# EasyEDA Pro project Relay_5x.epro

# Schematic Relay5x
Create Date: 2024-04-06; Page Name: P1; Project Name: LRIMa Agriculture Lite_2023-04-19_21-05-17; Schematic Name: Relay5x; Update Date: 2024-04-15; Company: EasyEDA.com; Drawn: EasyEDA; Page Size: A3; Part Number: JLCPCB-001; Reviewed: EasyEDA; Version: V0.1
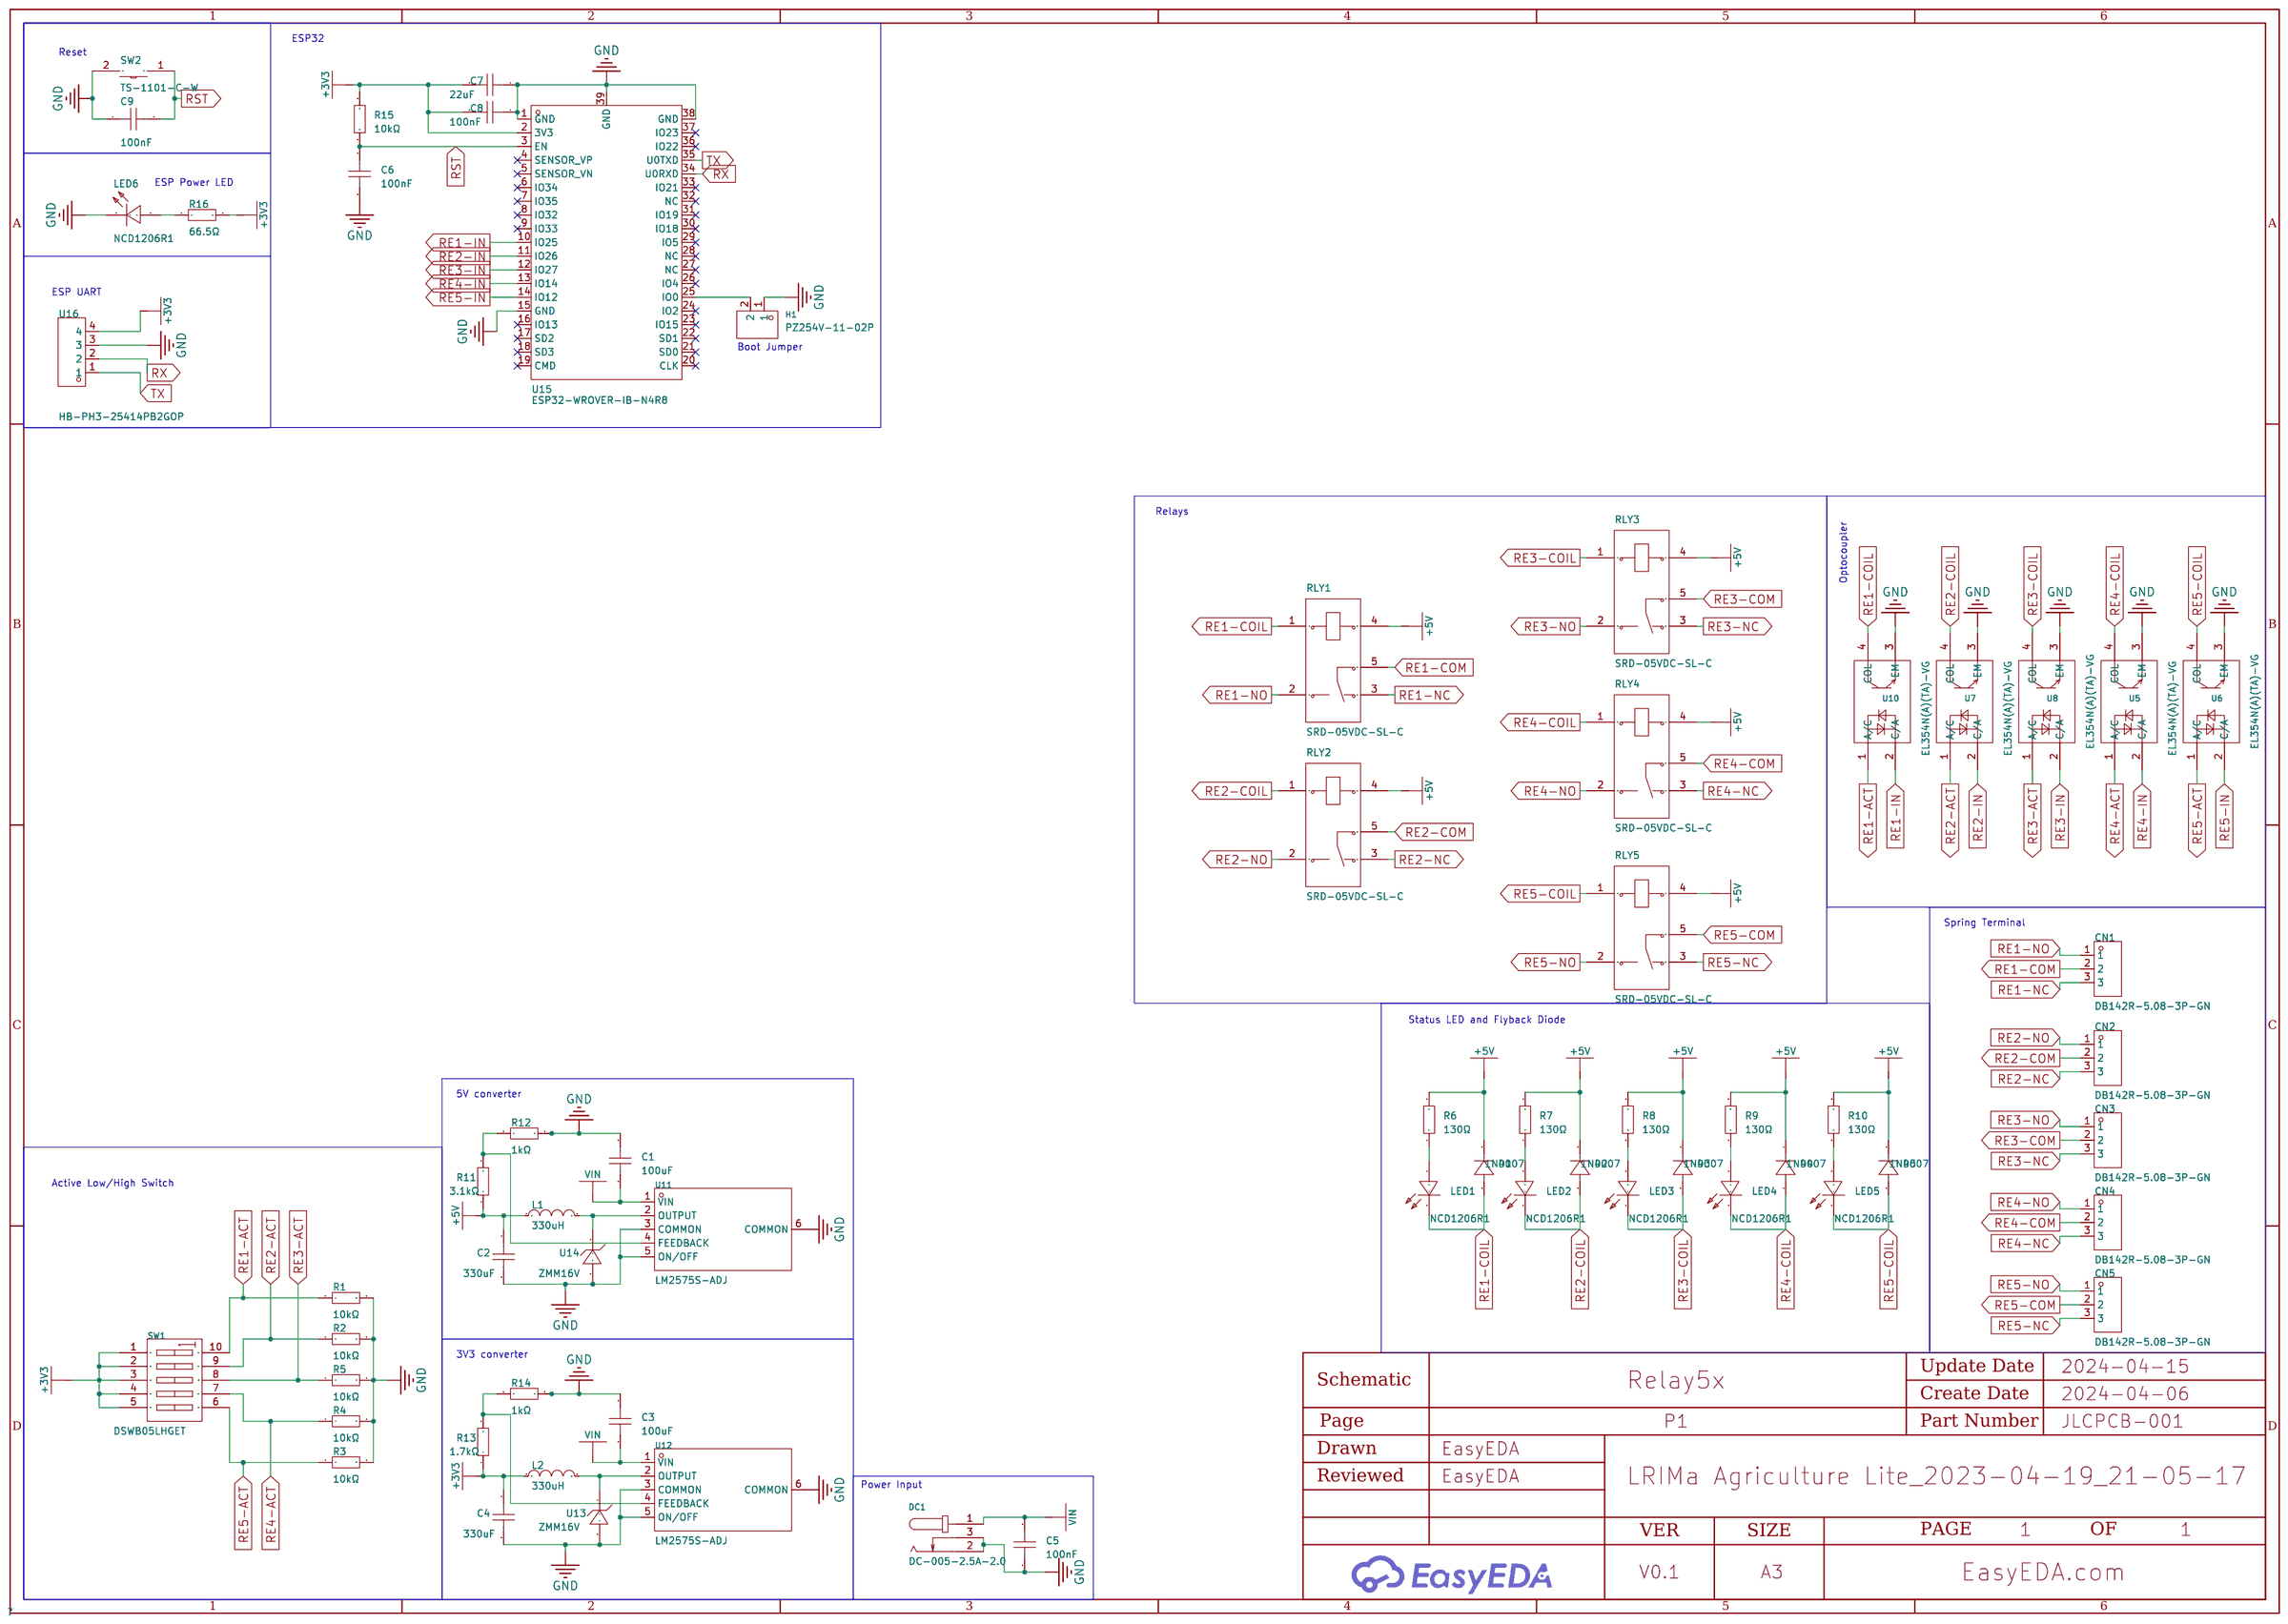
[diagram p0: schematic sheet]

## Parts
C1  100uF  [C1206]
C2  330uF  [C1210]
C3  100uF  [C1206]
C4  330uF  [C1210]
C5  100nF  [C1206]
C6  100nF  [C1206]
C7  22uF  [C1206]
C8  100nF  [C1206]
C9  100nF  [C1206]
CN1  DB142R-5.08-3P-GN  [CONN-TH_3P-P5.08_DIBO_DB142R-5.08-3P]
CN2  DB142R-5.08-3P-GN  [CONN-TH_3P-P5.08_DIBO_DB142R-5.08-3P]
CN3  DB142R-5.08-3P-GN  [CONN-TH_3P-P5.08_DIBO_DB142R-5.08-3P]
CN4  DB142R-5.08-3P-GN  [CONN-TH_3P-P5.08_DIBO_DB142R-5.08-3P]
CN5  DB142R-5.08-3P-GN  [CONN-TH_3P-P5.08_DIBO_DB142R-5.08-3P]
D1  1N4007  [DO-41_BD2.4-L4.7-P8.70-D0.9-RD]
D2  1N4007  [DO-41_BD2.4-L4.7-P8.70-D0.9-RD]
D3  1N4007  [DO-41_BD2.4-L4.7-P8.70-D0.9-RD]
D4  1N4007  [DO-41_BD2.4-L4.7-P8.70-D0.9-RD]
D5  1N4007  [DO-41_BD2.4-L4.7-P8.70-D0.9-RD]
DC1  DC-005-2.5A-2.0  [CONN-TH_DC-005-2.5A-2.0]
H1  PZ254V-11-02P  [HDR-TH_2P-P2.54-V-M]
L1  330uH  [L1210]
L2  330uH  [L1210]
LED1  NCD1206R1  [LED1206-R-RD_RED]
LED2  NCD1206R1  [LED1206-R-RD_RED]
LED3  NCD1206R1  [LED1206-R-RD_RED]
LED4  NCD1206R1  [LED1206-R-RD_RED]
LED5  NCD1206R1  [LED1206-R-RD_RED]
LED6  NCD1206R1  [LED1206-R-RD_RED]
R1  10kΩ  [R1206]
R2  10kΩ  [R1206]
R3  10kΩ  [R1206]
R4  10kΩ  [R1206]
R5  10kΩ  [R1206]
R6  130Ω  [R1206]
R7  130Ω  [R1206]
R8  130Ω  [R1206]
R9  130Ω  [R1206]
R10  130Ω  [R1206]
R11  3.1kΩ  [RES-TH_BD2.3-L3.7-P7.70-D0.9]
R12  1kΩ  [R1206]
R13  1.7kΩ  [RES-TH_BD2.7-L6.2-P10.20-D0.4]
R14  1kΩ  [R1206]
R15  10kΩ  [R1206]
R16  66.5Ω  [R1206]
RLY1  SRD-05VDC-SL-C  [RELAY-TH_SRD-XXVDC-XL-C]
RLY2  SRD-05VDC-SL-C  [RELAY-TH_SRD-XXVDC-XL-C]
RLY3  SRD-05VDC-SL-C  [RELAY-TH_SRD-XXVDC-XL-C]
RLY4  SRD-05VDC-SL-C  [RELAY-TH_SRD-XXVDC-XL-C]
RLY5  SRD-05VDC-SL-C  [RELAY-TH_SRD-XXVDC-XL-C]
SW1  DSWB05LHGET  [SW-TH_DSWB05LHGET]
SW2  TS-1101-C-W  [SW-SMD_L6.0-W3.3-LS8.0]
U5  EL354N(A)(TA)-VG  [OPTO-SMD-4_L4.4-W4.1-P2.54-LS7.0-TL]
U6  EL354N(A)(TA)-VG  [OPTO-SMD-4_L4.4-W4.1-P2.54-LS7.0-TL]
U7  EL354N(A)(TA)-VG  [OPTO-SMD-4_L4.4-W4.1-P2.54-LS7.0-TL]
U8  EL354N(A)(TA)-VG  [OPTO-SMD-4_L4.4-W4.1-P2.54-LS7.0-TL]
U10  EL354N(A)(TA)-VG  [OPTO-SMD-4_L4.4-W4.1-P2.54-LS7.0-TL]
U11  LM2575S-ADJ  [TO-263-5_L10.2-W8.9-P1.70-BR]
U12  LM2575S-ADJ  [TO-263-5_L10.2-W8.9-P1.70-BR]
U13  ZMM16V  [LL-34_L3.5-W1.5-RD]
U14  ZMM16V  [LL-34_L3.5-W1.5-RD]
U15  ESP32-WROVER-IB-N4R8  [WIFI-SMD_ESP32-WROVER-IE8MB]
U16  HB-PH3-25414PB2GOP  [HDR-TH_4P-P2.54-V-M]

## Library data of the parts
C1 C3 = CL31A107MQHNNNE: Capacitance: Tolerance:±20% Tolerance:±20% Voltage Rated: Temperature Coefficient:; LCSC Part Name: 100uF ±20% 6.3V; Supplier Part: C15008; Manufacturer: SAMSUNG(三星); Supplier Footprint: 1206; JLCPCB Part Class: Basic Part; Datasheet: https://atta.szlcsc.com/upload/public/pdf/source/20160218/1457707763339.pdf; Supplier: LCSC; Tolerance: ±20%
C2 C4 = GRM32ER60G337ME05L: Capacitance: Tolerance:±20% Tolerance:±20% Voltage Rated: Temperature Coefficient:; LCSC Part Name: 330uF ±20% 4V; Supplier Part: C528969; Manufacturer: muRata(村田); Supplier Footprint: 1210; JLCPCB Part Class: Extended Part; Datasheet: https://atta.szlcsc.com/upload/public/pdf/source/20200508/C528969_75E4B245FA13E53178DDC9C6358EA87E.pdf; Supplier: LCSC; Tolerance: ±20%
C5 C6 C8 C9 = 1206B104K101NT: Capacitance:100nF Tolerance:±10% Tolerance:±10% Voltage Rated: Temperature Coefficient:; LCSC Part Name: 100nF ±10% 100V; Supplier Part: C110255; Manufacturer: FH(风华); Supplier Footprint: 1206; JLCPCB Part Class: Extended Part; Datasheet: https://atta.szlcsc.com/upload/public/pdf/source/20200305/C486355_26A10D38EF8C2A5C37091D0039909270.pdf; Supplier: LCSC; Tolerance: ±10%
C7 = CL31A226KOHNNNE: Capacitance: Tolerance:±10% Tolerance:±10% Voltage Rated: Temperature Coefficient:; LCSC Part Name: 22uF ±10% 16V; Supplier Part: C90146; Manufacturer: SAMSUNG(三星); Supplier Footprint: 1206; JLCPCB Part Class: Extended Part; Datasheet: https://atta.szlcsc.com/upload/public/pdf/source/20161228/1482890861309.pdf; Supplier: LCSC; Tolerance: ±10%
CN1-CN5 = DB142R-5.08-3P-GN: Structure:1x3P Pitch:5.08mm Color:Green Mounting Style:- Number of Pins:3P Number of PINs Per Row:3 Current Rating (Max):15A Voltage Rating (Max):250V Wire Gauge - AWG:16~22 Wire Gauge - mm2:0.2~1.5 Operating Temperature Range:-40℃~+105℃ Operating Tempera; LCSC Part Name: 1x3P 5.08mm 每排P数:3 排数:1; Supplier Part: C2898710; Manufacturer: DORABO(地博电气); Supplier Footprint: 弯插,P=5.08mm; JLCPCB Part Class: Extended Part; Datasheet: https://atta.szlcsc.com/upload/public/pdf/source/20230627/D44C7807FE032969C21692DA46FBD086.pdf; Supplier: LCSC; Structure: 1x3P; Pitch: 5.08mm; Color: Green; Number of Pins: 3P; Number of PINs Per Row: 3; Current Rating (Max): 15A; Voltage Rating (Max): 250V; Wire Gauge - AWG: 16~22; Wire Gauge - mm2: 0.2~1.5; Operating Temperature Range: -40℃~+105℃; Number of Rows: 1
D1-D5 = 1N4007_C280372: Diode Configuration: Forward Voltage (Vf@If):1.1V@1A Reverse Voltage (Vr): Average Rectified Current (Io): Reverse Leakage Current:5uA@1kV; LCSC Part Name: 电压:1kV 电流:1A; Supplier Part: C280372; Manufacturer: GOOD-ARK(固锝); Supplier Footprint: DO-41; JLCPCB Part Class: Extended Part; Datasheet: https://atta.szlcsc.com/upload/public/pdf/source/20180930/C280372_70790C891A26D869B5D8DAAB2EBF11C4.pdf; Supplier: LCSC; Forward Voltage (Vf@If): 1.1V@1A; Reverse Leakage Current: 5uA@1kV
DC1 = DC-005-2.5A-2.0: Connector Type:DC Power Receptacle Mounting Style:Panel Mounting Inside Contact Diameter:2mm Outside Contact Diameter:6.2mm Current Rating (Max):2.5A Voltage Rating (Max):24V Contact Material:Brass Operating Temperature Range:-20℃~+70℃ Operating Temperatu; LCSC Part Name: DC电源插座 内径:2mm 外径:6.2mm; Supplier Part: C319099; Manufacturer: XKB Connectivity(中国星坤); Supplier Footprint: 插件; JLCPCB Part Class: Extended Part; Datasheet: https://atta.szlcsc.com/upload/public/pdf/source/20230410/3C172F25A51FCA230ABE6D36425CBB3B.pdf; Supplier: LCSC; Connector Type: DC Power Receptacle; Mounting Style: Panel Mounting; Inside Contact Diameter: 2mm; Outside Contact Diameter: 6.2mm; Current Rating (Max): 2.5A; Voltage Rating (Max): 24V; Contact Material: Brass; Operating Temperature Range: -20℃~+70℃; Soldering Temperature(Max): 260℃
H1 = PZ254V-11-02P: Pin Structure:1x2P Pitch:2.54mm Row Spacing:- Circluar Pins/Square Pins:Square Pins Mounting Type:Straight Number of Rows:Plugin Number of Pins:2P Current Rating (Max):- Voltage Rating (Max):- Length of Mating Pin:6mm Insulation Height:2.5mm Length of End; LCSC Part Name: 间距:2.54mm 1x2P 直插 方针; Supplier Part: C492401; Manufacturer: XFCN(兴飞); Supplier Footprint: 插件,P=2.54mm; JLCPCB Part Class: Extended Part; Datasheet: https://atta.szlcsc.com/upload/public/pdf/source/20200309/C492401_A812433581A9B211A7FFA413ADDFF0E5.pdf; Supplier: LCSC; Pin Structure: 1x2P; Pitch: 2.54mm; Circluar Pins/Square Pins: Square Pins; Mounting Type: Straight; Number of Rows: Plugin; Number of Pins: 2P; Length of Mating Pin: 6mm; Insulation Height: 2.5mm; Length of End Connection Pin: 3mm; Operating Temperature Range: -40℃~+105℃; Color: Black
L1 L2 = NLCV32T-331K-PF: Inductance: Tolerance:±10% Tolerance:±10% Rated Current: Saturation Current (Isat):- DC Resistance (DCR):12.3Ω Ratings:-; LCSC Part Name: 330uH ±10%; Supplier Part: C87557; Manufacturer: TDK; Supplier Footprint: 1210; JLCPCB Part Class: Extended Part; Datasheet: https://atta.szlcsc.com/upload/public/pdf/source/20180928/C250189_4EAD15528E1AEC88ABB410F9A5CD04B4.pdf; Supplier: LCSC; Tolerance: ±10%; DC Resistance (DCR): 12.3Ω
LED1-LED6 = NCD1206R1_C84270: Emitted Color:Red Forward Voltage (VF):1.6V~2.6V Forward Voltage (VF):1.6V~2.6V Power Dissipation:65mW Forward Current:20mA Dominant Wavelength:615nm~630nm Dominant Wavelength:615nm~630nm Lens Color:无色透明透镜 Luminous Intensity:67mcd~195mcd Luminous Intensit; Supplier Part: C84270; Manufacturer: 国星光电; Supplier Footprint: 1206; JLCPCB Part Class: Extended Part; Datasheet: https://atta.szlcsc.com/upload/public/pdf/source/20200820/C84270_26D056BA53480CD9796A84C2EB45318C.pdf; Supplier: LCSC; Emitted Color: Red; Forward Voltage (VF): 1.6V~2.6V; Power Dissipation: 65mW; Forward Current: 20mA; Dominant Wavelength: 615nm~630nm; Lens Color: 无色透明透镜; Luminous Intensity: 67mcd~195mcd; Viewing Angle: 130°; Operating Temperature: -30℃~+85℃
R1-R5 R15 = 1206W4F1002T5E: Type:Thick Film Resistors Resistance:10kΩ Tolerance:±1% Tolerance:±1% Power(Watts): Overload Voltage (Max): Temperature Coefficient:±100ppm/℃ Temperature Coefficient:±100ppm/℃ Operating Temperature Range:-55℃~+155℃ Operating Temperature Range:-55℃~+155℃; LCSC Part Name: 10kΩ ±1% 250mW 厚膜电阻; Supplier Part: C17902; Manufacturer: UNI-ROYAL(厚声); Supplier Footprint: 1206; JLCPCB Part Class: Basic Part; Datasheet: https://atta.szlcsc.com/upload/public/pdf/source/20200306/C422600_1E6D84923E4A46A82E41ADD87F860B5C.pdf; Supplier: LCSC; Type: Thick Film Resistors; Tolerance: ±1%; Temperature Coefficient: ±100ppm/℃; Operating Temperature Range: -55℃~+155℃
R6-R10 = ARG06FTC1300: Type:Thin Film Resistor Resistance: Tolerance:±1% Tolerance:±1% Power(Watts):250mW Overload Voltage (Max): Temperature Coefficient:±25ppm/℃ Temperature Coefficient:±25ppm/℃ Operating Temperature Range:-55℃~+155℃ Operating Temperature Range:-55℃~+155℃; LCSC Part Name: 薄膜电阻 130Ω ±1% 250mW; Supplier Part: C309090; Manufacturer: Viking(光颉); Supplier Footprint: 1206; JLCPCB Part Class: Extended Part; Datasheet: https://atta.szlcsc.com/upload/public/pdf/source/20190816/C412422_E173BA386C6DD8245B6A88358EF9877A.pdf; Supplier: LCSC; Type: Thin Film Resistor; Tolerance: ±1%; Power(Watts): 250mW; Temperature Coefficient: ±25ppm/℃; Operating Temperature Range: -55℃~+155℃
R11 = MF1/8W-3K1±1%-ST52: Type:Metal Film Resistors Resistance:3.1kΩ Tolerance:±1% Tolerance:±1% Overload Voltage (Max):200V Power(Watts):125mW Temperature Coefficient:±100ppm/℃ Temperature Coefficient:±100ppm/℃ Operating Temperature Range:-55℃~+155℃ Operating Temperature Range:-5; LCSC Part Name: 金属膜电阻 3.1kΩ ±1% 125mW; Supplier Part: C2903351; Manufacturer: VO(翔胜); Supplier Footprint: 插件,2.3x3.7mm; JLCPCB Part Class: Extended Part; Datasheet: https://atta.szlcsc.com/upload/public/pdf/source/20200609/C601728_5AA4C0C8E12E11069DA2C3356F29D1F2.pdf; Supplier: LCSC; Type: Metal Film Resistors; Tolerance: ±1%; Overload Voltage (Max): 200V; Power(Watts): 125mW; Temperature Coefficient: ±100ppm/℃; Operating Temperature Range: -55℃~+155℃
R12 R14 = 1206W4F1001T5E_C4410: Type:Thick Film Resistors Resistance:1kΩ Tolerance:±1% Tolerance:±1% Power(Watts): Overload Voltage (Max): Operating Temperature Range:-55℃~+155℃ Operating Temperature Range:-55℃~+155℃; LCSC Part Name: 1kΩ ±1% 250mW 厚膜电阻; Supplier Part: C4410; Manufacturer: UNI-ROYAL(厚声); Manufacturer Part: 1206W4F1001T5E; Supplier Footprint: 1206; JLCPCB Part Class: Basic Part; Datasheet: https://atta.szlcsc.com/upload/public/pdf/source/20200306/C422600_1E6D84923E4A46A82E41ADD87F860B5C.pdf; Supplier: LCSC; Type: Thick Film Resistors; Tolerance: ±1%; Operating Temperature Range: -55℃~+155℃
R13 = MF1/4W-1K7±1%-ST26: Type:Metal Film Resistors Resistance:1.7kΩ Tolerance:±1% Tolerance:±1% Overload Voltage (Max):250V Power(Watts):250mW Temperature Coefficient:±100ppm/℃ Temperature Coefficient:±100ppm/℃ Operating Temperature Range:-55℃~+155℃ Operating Temperature Range:-5; LCSC Part Name: 金属膜电阻 1.7kΩ ±1% 250mW; Supplier Part: C2903257; Manufacturer: VO(翔胜); Supplier Footprint: 插件,2.7x6.2mm; JLCPCB Part Class: Extended Part; Datasheet: https://atta.szlcsc.com/upload/public/pdf/source/20200609/C601728_5AA4C0C8E12E11069DA2C3356F29D1F2.pdf; Supplier: LCSC; Type: Metal Film Resistors; Tolerance: ±1%; Overload Voltage (Max): 250V; Power(Watts): 250mW; Temperature Coefficient: ±100ppm/℃; Operating Temperature Range: -55℃~+155℃
R16 = CR1206F66R5P05Z: Type:Thick Film Resistors Resistance: Tolerance:±1% Tolerance:±1% Power(Watts):250mW Overload Voltage (Max): Temperature Coefficient:±100ppm/℃ Temperature Coefficient:±100ppm/℃ Operating Temperature Range:-55℃~+155℃ Operating Temperature Range:-55℃~+155℃; LCSC Part Name: 厚膜电阻 66.5Ω ±1% 250mW; Supplier Part: C245590; Manufacturer: EVER OHMS(天二科技); Supplier Footprint: 1206; JLCPCB Part Class: Extended Part; Datasheet: https://atta.szlcsc.com/upload/public/pdf/source/20200113/C482024_EFFFA47EA0B3A01639CDA1264BD0AF46.pdf; Supplier: LCSC; Type: Thick Film Resistors; Tolerance: ±1%; Power(Watts): 250mW; Overload Voltage (Max): 250V; Temperature Coefficient: ±100ppm/℃; Operating Temperature Range: -55℃~+155℃
RLY1-RLY5 = SRD-05VDC-SL-C: Coil Voltage:5V Contact Form:一组转换:1C(SPDT-转换) Pin Number:5 Contact Rating:- Maximum Switching Voltage:250V@AC Coil Rated Power:360mW Maximum Switching Current:15A Coil Type:无极性-单线圈 Coil Resistance:70Ω Contact Resistance:100mΩ Operate Time:10ms Release Tim; LCSC Part Name: 蓝色; Supplier Part: C35449; Manufacturer: 松乐; Supplier Footprint: 插件,15.6x19.2mm; JLCPCB Part Class: Extended Part; Datasheet: https://atta.szlcsc.com/upload/public/pdf/source/20200305/C490149_C96E4098A3B1FFB377D5AD2E40B7C2A8.pdf; Supplier: LCSC; Coil Voltage: 5V; Contact Form: 一组转换:1C(SPDT-转换); Pin Number: 5; Maximum Switching Voltage: 250V@AC; Coil Rated Power: 360mW; Maximum Switching Current: 15A; Coil Type: 无极性-单线圈; Coil Resistance: 70Ω; Contact Resistance: 100mΩ; Operate Time: 10ms; Release Time: 10ms
SW1 = DSWB05LHGET: Type:平拨,凸起式 Circuit:SPST Number of Positions:5Bit Lead Pitch:2.54mm Operating Life:- Color:Red; LCSC Part Name: 2.54mm 红色宽体5位顶拨插件; Supplier Part: C126889; Manufacturer: YE; Supplier Footprint: 插件; JLCPCB Part Class: Extended Part; Datasheet: https://atta.szlcsc.com/upload/public/pdf/source/20170824/C126889_1503565980398906651.pdf; Supplier: LCSC; Type: 平拨,凸起式; Circuit: SPST; Number of Positions: 5Bit; Lead Pitch: 2.54mm; Color: Red
SW2 = TS-1101-C-W: Contact Current:50mA Voltage Rating (AC):- Voltage Rating (DC):12V Power Rating:- Insulation Resistance:- Circuit:SPST Mounting Style:Brick nogging Actuator Style:Rectangle button Actuator/Cap Color:白色带淡绿 With Lamp:No Operating Force:260gf Mechanical Life; LCSC Part Name: 立贴 6*3.6*2.5mm 轻触开关 一型3*6*2.5有白ZD b拉伸白色带淡绿按键 卷装; Supplier Part: C318938; Manufacturer: XKB Connectivity(中国星坤); Supplier Footprint: SMD; JLCPCB Part Class: Extended Part; Datasheet: https://atta.szlcsc.com/upload/public/pdf/source/20200227/C318938_C2E53B1EEDE37D980A33616AC086DE53.pdf; Supplier: LCSC; Contact Current: 50mA; Voltage Rating (DC): 12V; Circuit: SPST; Mounting Style: Brick nogging; Actuator Style: Rectangle button; Actuator/Cap Color: 白色带淡绿; With Lamp: No; Operating Force: 260gf; Mechanical Life: 50000次; Operating Temperature: -30℃~+85℃; Switch Length: 6mm; Switch Width: 3.6mm; Switch Height: 2.5mm; Strike Gundam: NO
U5-U8 U10 = EL354N(A)(TA)-VG: Input voltage type:AC,DC Output Type:光电三极管 Forward Voltage:1.2V Output Current:- Isolation Voltage(rms):3.75kV Reverse Voltage:- Receiving End Voltage:80V Number of Outputs:1 Collector-Emitter Saturation Voltage (Vce(sat)@Ic,IF):100mV@1mA,20mA Rise time:1; LCSC Part Name: AC,DC输入 隔离电压(rms):3750V; Supplier Part: C146213; Manufacturer: EVERLIGHT(亿光); Supplier Footprint: SOP-4-2.54mm; JLCPCB Part Class: Extended Part; Datasheet: https://atta.szlcsc.com/upload/public/pdf/source/20181121/C329176_061E6ABD1337E5DFDBD43AE8D4C4997A.pdf; Supplier: LCSC; Input voltage type: AC,DC; Output Type: 光电三极管; Forward Voltage: 1.2V; Isolation Voltage(rms): 3.75kV; Receiving End Voltage: 80V; Number of Outputs: 1; Collector-Emitter Saturation Voltage (Vce(sat)@Ic,IF): 100mV@1mA,20mA; Rise time: 18us@2mA,100Ω; Fall time: 18us@2mA,100Ω; Operating Temperature: -55℃~+100℃
U11 U12 = LM2575S-ADJ: Supplier Part: C880734; Manufacturer: Slkor(萨科微); Supplier Footprint: TO-263-5; JLCPCB Part Class: Extended Part; Datasheet: https://atta.szlcsc.com/upload/public/pdf/source/20201013/C880732_113AE00E4A84AF37E5AE3751FD9C4F1A.pdf; Supplier: LCSC
U13 U14 = ZMM16V: Diode Configuration:Single Zener Voltage (Nom):16V Zener Voltage (Range):15.3V~17.1V Zener Voltage (Range):15.3V~17.1V Power Dissipation:500mW Zener Impedance (Zzt):40Ω; Supplier Part: C2891756; Manufacturer: YONGYUTAI(永裕泰); Supplier Footprint: LL-34; JLCPCB Part Class: Extended Part; Datasheet: https://atta.szlcsc.com/upload/public/pdf/source/20210901/1E62BEB6ADBB84BC625F53DAC2865793.pdf; Supplier: LCSC; Diode Configuration: Single; Zener Voltage (Nom): 16V; Zener Voltage (Range): 15.3V~17.1V; Power Dissipation: 500mW; Zener Impedance (Zzt): 40Ω
U15 = ESP32-WROVER-IB-N4R8: LCSC Part Name: 通用型Wi-Fi+BT+BLE MCU模组; Supplier Part: C2973681; Manufacturer: ESPRESSIF(乐鑫); Supplier Footprint: SMD,18x31.4mm; JLCPCB Part Class: Extended Part; Datasheet: https://atta.szlcsc.com/upload/public/pdf/source/20220601/DD79C4CEB8DC81A9F09F25DD1F7FF9B2.pdf; Supplier: LCSC
U16 = HB-PH3-25414PB2GOP: Pin Structure:1x4P Pitch:2.54mm Row Spacing:2.54mm Circluar Pins/Square Pins:Square Pins Mounting Type:Straight Number of Rows:Plugin Number of Pins:4P Current Rating (Max):3A Voltage Rating (Max):250V Length of Mating Pin:6mm Insulation Height:2.54mm Len; LCSC Part Name: 间距:2.54mm 1x4P 直插 方针; Supplier Part: C6332197; Manufacturer: HANBO(汉博); Supplier Footprint: 插件,P=2.54mm; JLCPCB Part Class: Extended Part; Datasheet: https://atta.szlcsc.com/upload/public/pdf/source/20230803/F72D259687963761DF1B552F3BB84A31.pdf; Supplier: LCSC; Pin Structure: 1x4P; Pitch: 2.54mm; Row Spacing: 2.54mm; Circluar Pins/Square Pins: Square Pins; Mounting Type: Straight; Number of Rows: Plugin; Number of Pins: 4P; Current Rating (Max): 3A; Voltage Rating (Max): 250V; Length of Mating Pin: 6mm; Insulation Height: 2.54mm; Length of End Connection Pin: 3mm; Contact Plating: Gold; Operating Temperature Range: -40℃~+105℃; Soldering Temperature(Max): 260℃; Color: Black

## Nets
+3V3: C4.1 C7.2 C8.2 L2.1 R13.1 R15.2 R16.2 SW1.1(A1) SW1.2(A2) SW1.3(A3) SW1.4(A4) SW1.5(A5) U15.2(3V3) U16.4
+5V: C2.1 D1.1(K) D2.1(K) D3.1(K) D4.1(K) D5.1(K) L1.1 R6.2 R7.2 R8.2 R9.2 R10.2 R11.1 RLY1.4 RLY2.4 RLY3.4 RLY4.4 RLY5.4
GND: C1.1 C2.2 C3.1 C4.2 C5.2 C6.2 C7.1 C8.1 C9.1 DC1.2 DC1.3 H1.1 LED6.2(K) R1.2 R2.2 R3.2 R4.2 R5.2 R12.1 R14.1 SW2.2 U5.3(EM) U6.3(EM) U7.3(EM) U8.3(EM) U10.3(EM) U11.3(COMMON) U11.5(ON/OFF) U11.6(COMMON) U12.3(COMMON) U12.5(ON/OFF) U12.6(COMMON) U13.2(A) U14.2(A) U15.1(GND) U15.15(GND) U15.38(GND) U15.39(GND) U16.3
VIN: C1.2 C3.2 C5.1 DC1.1 U11.1(VIN) U12.1(VIN)
RE1-ACT: R1.1 SW1.10(B1) U10.1(A/C)
RE1-COIL: D1.2(A) LED1.2(K) RLY1.1 U10.4(COL)
RE1-COM: CN1.2 RLY1.5
RE1-IN: U10.2(C/A) U15.10(IO25)
RE1-NC: CN1.3 RLY1.3
RE1-NO: CN1.1 RLY1.2
RE2-ACT: R2.1 SW1.9(B2) U7.1(A/C)
RE2-COIL: D2.2(A) LED2.2(K) RLY2.1 U7.4(COL)
RE2-COM: CN2.2 RLY2.5
RE2-IN: U7.2(C/A) U15.11(IO26)
RE2-NC: CN2.3 RLY2.3
RE2-NO: CN2.1 RLY2.2
RE3-ACT: R5.1 SW1.8(B3) U8.1(A/C)
RE3-COIL: D3.2(A) LED3.2(K) RLY3.1 U8.4(COL)
RE3-COM: CN3.2 RLY3.5
RE3-IN: U8.2(C/A) U15.12(IO27)
RE3-NC: CN3.3 RLY3.3
RE3-NO: CN3.1 RLY3.2
RE4-ACT: R4.1 SW1.7(B4) U5.1(A/C)
RE4-COIL: D4.2(A) LED4.2(K) RLY4.1 U5.4(COL)
RE4-COM: CN4.2 RLY4.5
RE4-IN: U5.2(C/A) U15.13(IO14)
RE4-NC: CN4.3 RLY4.3
RE4-NO: CN4.1 RLY4.2
RE5-ACT: R3.1 SW1.6(B5) U6.1(A/C)
RE5-COIL: D5.2(A) LED5.2(K) RLY5.1 U6.4(COL)
RE5-COM: CN5.2 RLY5.5
RE5-IN: U6.2(C/A) U15.14(IO12)
RE5-NC: CN5.3 RLY5.3
RE5-NO: CN5.1 RLY5.2
RST: C6.1 C9.2 R15.1 SW2.1 U15.3(EN)
RX: U15.34(U0RXD) U16.2
TX: U15.35(U0TXD) U16.1
$1N1874: LED1.1(A) R6.1
$1N2733: LED2.1(A) R7.1
$1N2848: LED3.1(A) R8.1
$1N2963: LED4.1(A) R9.1
$1N3078: LED5.1(A) R10.1
$1N7448: L1.2 U11.2(OUTPUT) U14.1(K)
$1N7557: R11.2 R12.2 U11.4(FEEDBACK)
$1N7965: L2.2 U12.2(OUTPUT) U13.1(K)
$1N7972: R13.2 R14.2 U12.4(FEEDBACK)
$1N9867: H1.2 U15.25(IO0)
$1N10273: LED6.1(A) R16.1

Not connected (* = marked no-connect by the designer): U15 4(SENSOR_VP)* 5(SENSOR_VN)* 6(IO34)* 7(IO35)* 8(IO32)* 9(IO33)* 16(IO13)* 17(SD2)* 18(SD3)* 19(CMD)* 20(CLK)* 21(SD0)* 22(SD1)* 23(IO15)* 24(IO2)* 26(IO4)* 27(NC)* 28(NC)* 29(IO5)* 30(IO18)* 31(IO19)* 32(NC)* 33(IO21)* 36(IO22)* 37(IO23)*

## Notes on the sheet
- ESP32
- Reset
- ESP Power LED
- ESP UART
- Boot Jumper
- Relays
- Optocoupler
- Spring Terminal
- Status LED and Flyback Diode
- 5V converter
- Active Low/High Switch
- 3V3 converter
- Power Input

# Board Relay 5x
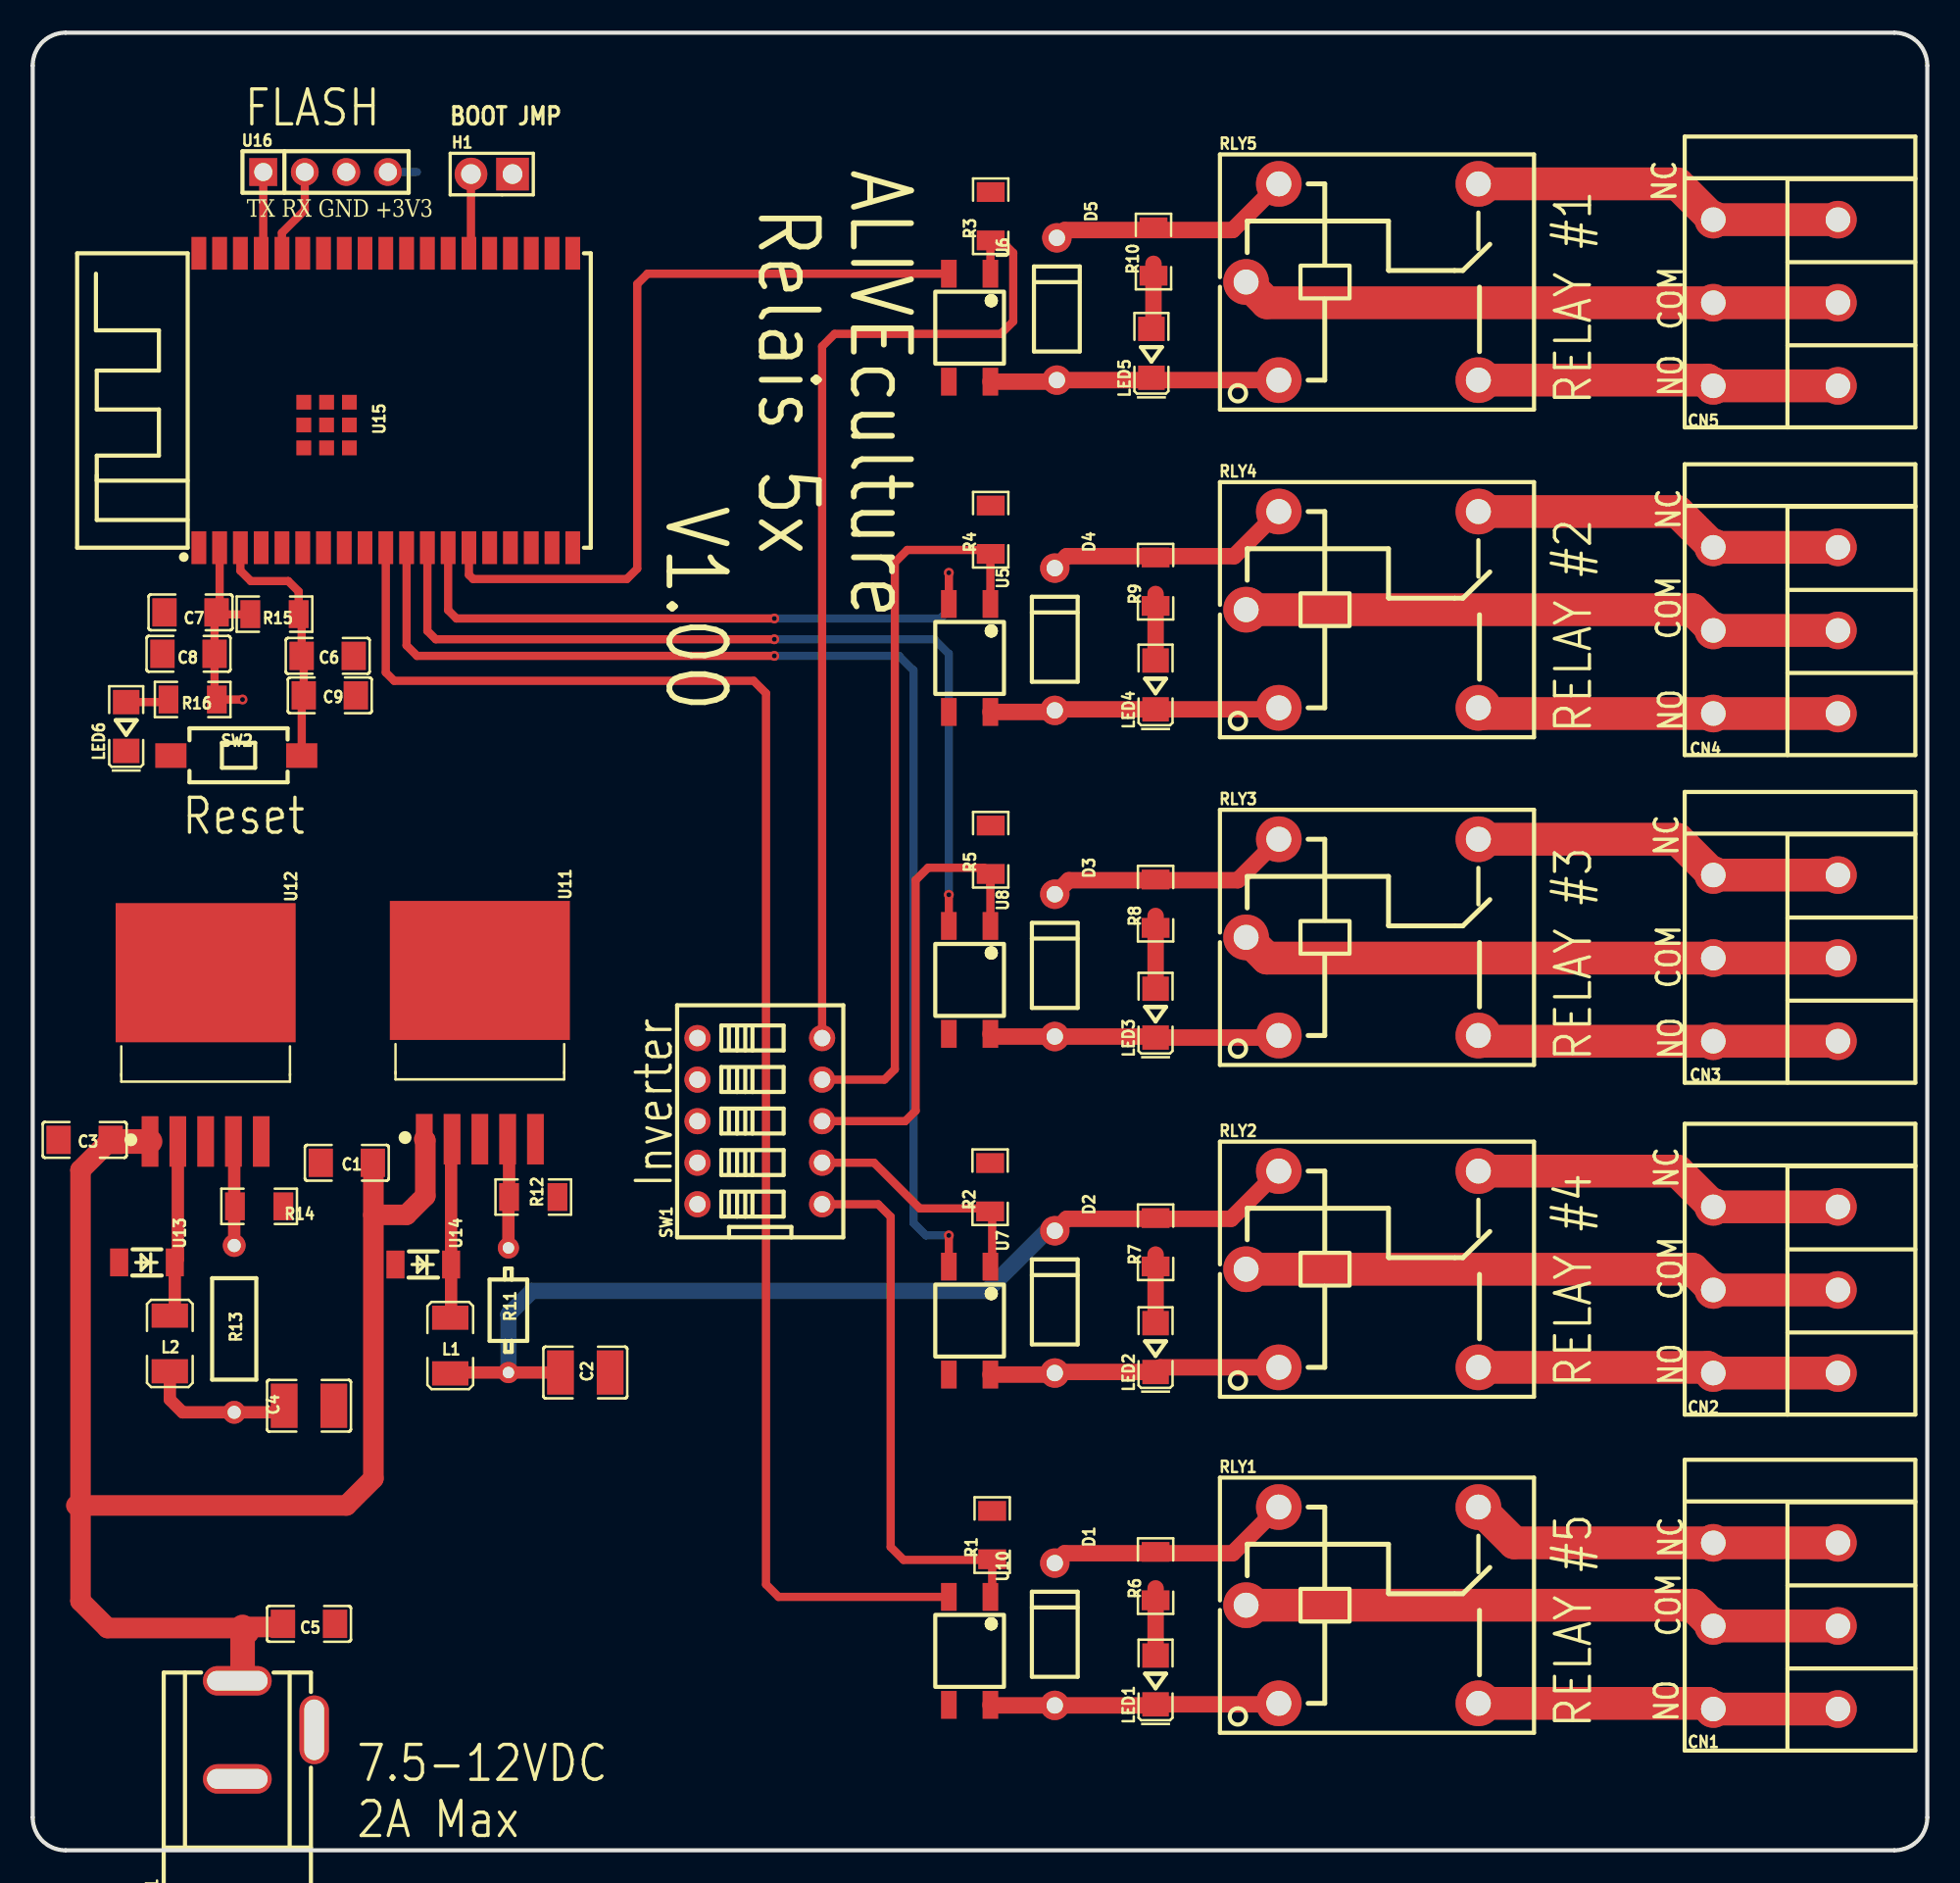
[diagram p1: board, top side]
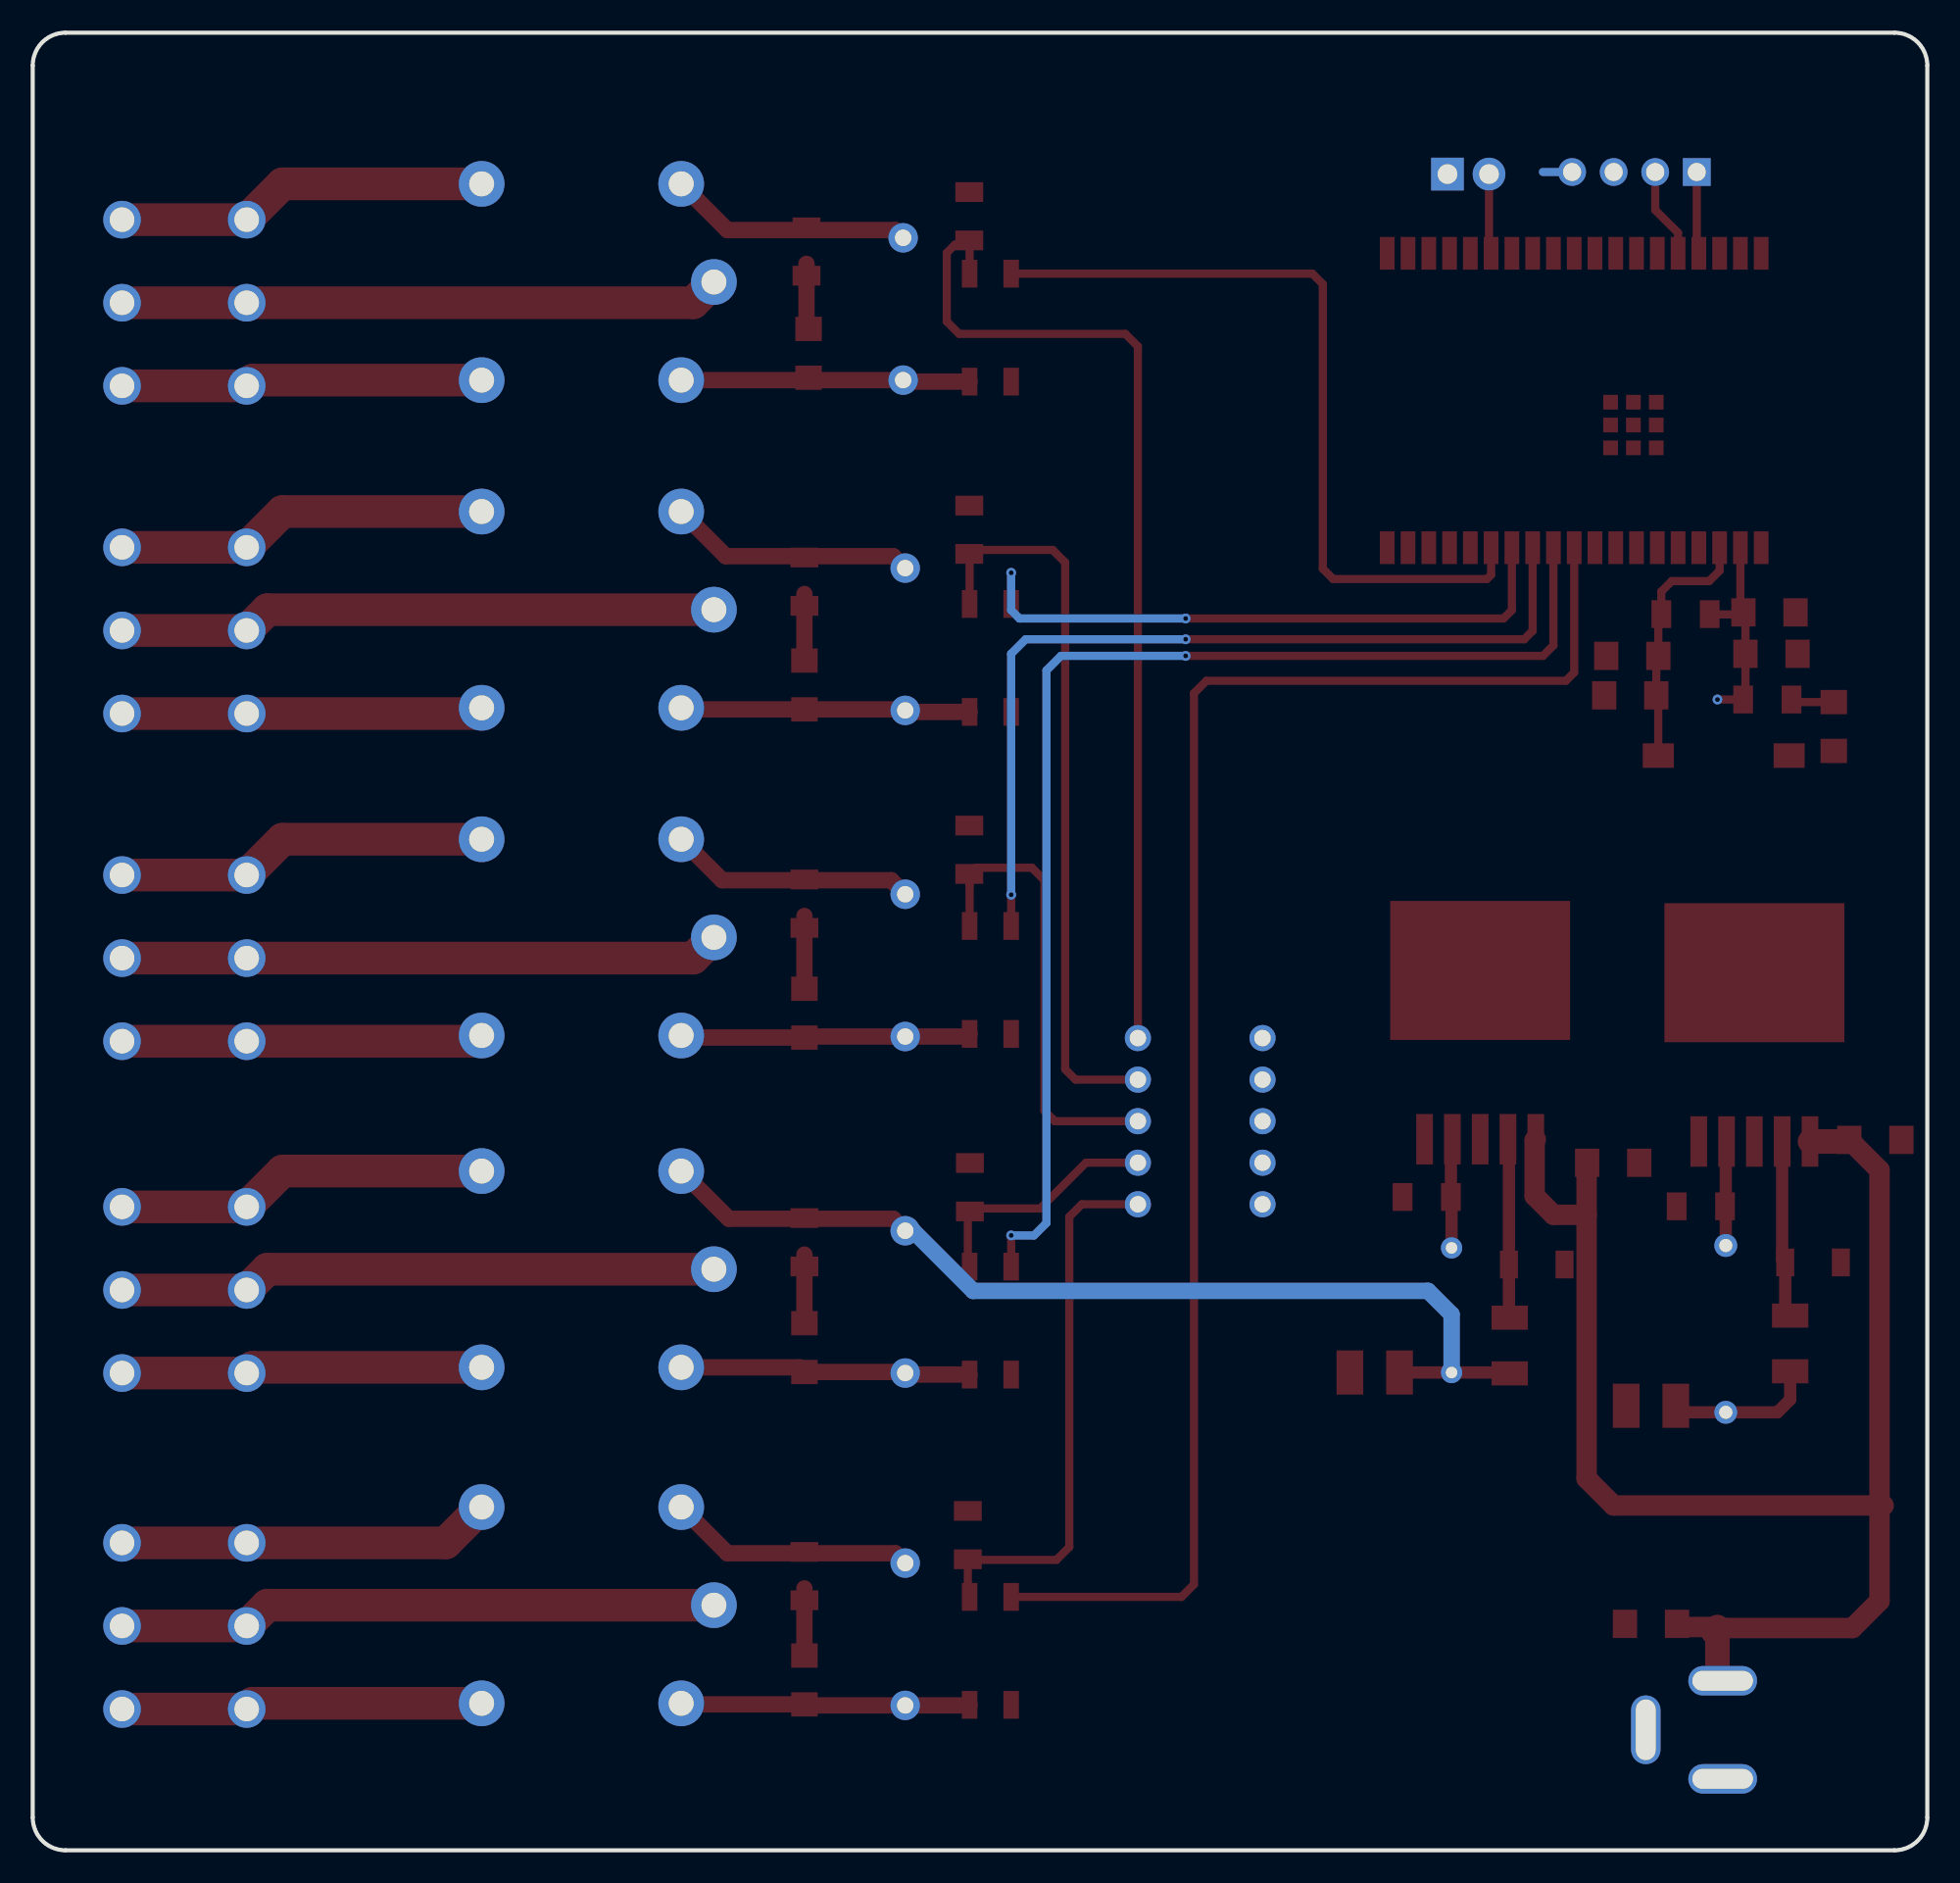
[diagram p2: board, bottom side, seen from below]

Outline 115.82 x 111.12 mm; copper layers: Top Layer, Bottom Layer. Coordinates in mm from the lower left corner of the outline.
Outline path: 0,109.12 0,2 arc(0.59,0.59) 2,0 113.82,0 arc(115.24,0.59) 115.82,2 115.82,109.12 arc(115.24,110.54) 113.82,111.12 2,111.12 arc(0.59,110.54) 0,109.12
Stack: Top Layer 0.035mm / Dielectric1 1.51mm FR4 er 4.5 / Bottom Layer 0.035mm

## Design rules (mm)
template: Custom Config
spacing copperThickness1oz (default): track to track 0.102, other pairs 0.152 to 0.3
spacing copperThickness2oz: track to track 0.203, other pairs 0.152 to 0.3
track width copperThickness1oz (default): min 0.127, default 0.254, max 2.54
track width copperThickness2oz: min 0.203, default 0.254, max 2.54
differential pair differentialPair (default): width min 0.127, default 0.254, max 2.54; gap min 0.152, default 0.152
via viaSize (default): diameter min 0.5, default 0.61, max 10; hole min 0.3, default 0.305, max 6.3

## Placement (name value [footprint] x y rotation side)
C1  100uF  [C1206]  19.2 42.03 0 top
C2  330uF  [C1210]  33.78 29.21 0 top
C3  100uF  [C1206]  3.17 43.43 0 top
C4  330uF  [C1210]  16.89 27.18 0 top
C5  100nF  [C1206]  16.89 13.84 0 top
C6  100nF  [C1206]  18.03 73.02 0 top
C7  22uF  [C1206]  9.65 75.68 0 top
C8  100nF  [C1206]  9.53 73.15 0 top
C9  100nF  [C1206]  18.16 70.61 180 top
CN1  DB142R-5.08-3P-GN  [CONN-TH_3P-P5.08_DIBO_DB142R-5.08-3P]  106.55 13.72 90 top
CN2  DB142R-5.08-3P-GN  [CONN-TH_3P-P5.08_DIBO_DB142R-5.08-3P]  106.55 34.26 90 top
CN3  DB142R-5.08-3P-GN  [CONN-TH_3P-P5.08_DIBO_DB142R-5.08-3P]  106.55 54.55 90 top
CN4  DB142R-5.08-3P-GN  [CONN-TH_3P-P5.08_DIBO_DB142R-5.08-3P]  106.55 74.58 90 top
CN5  DB142R-5.08-3P-GN  [CONN-TH_3P-P5.08_DIBO_DB142R-5.08-3P]  106.55 94.61 90 top
D1  1N4007  [DO-41_BD2.4-L4.7-P8.70-D0.9-RD]  62.48 13.21 270 top
D2  1N4007  [DO-41_BD2.4-L4.7-P8.70-D0.9-RD]  62.48 33.53 270 top
D3  1N4007  [DO-41_BD2.4-L4.7-P8.70-D0.9-RD]  62.48 54.1 270 top
D4  1N4007  [DO-41_BD2.4-L4.7-P8.70-D0.9-RD]  62.48 74.04 270 top
D5  1N4007  [DO-41_BD2.4-L4.7-P8.70-D0.9-RD]  62.61 94.23 270 top
DC1  DC-005-2.5A-2.0  [CONN-TH_DC-005-2.5A-2.0]  14.86 7.37 90 top
H1  PZ254V-11-02P  [HDR-TH_2P-P2.54-V-M]  28.06 102.48 180 top
L1  330uH  [L1210]  25.53 30.86 90 top
L2  330uH  [L1210]  8.38 30.99 90 top
LED1  NCD1206R1  [LED1206-R-RD_RED]  68.65 10.41 90 top
LED2  NCD1206R1  [LED1206-R-RD_RED]  68.65 30.73 90 top
LED3  NCD1206R1  [LED1206-R-RD_RED]  68.65 51.18 90 top
LED4  NCD1206R1  [LED1206-R-RD_RED]  68.65 71.25 90 top
LED5  NCD1206R1  [LED1206-R-RD_RED]  68.39 91.52 90 top
LED6  NCD1206R1  [LED1206-R-RD_RED]  5.72 68.71 90 top
R1  10kΩ  [R1206]  58.66 19.27 90 top
R2  10kΩ  [R1206]  58.53 40.54 90 top
R3  10kΩ  [R1206]  58.57 99.9 90 top
R4  10kΩ  [R1206]  58.57 80.74 90 top
R5  10kΩ  [R1206]  58.57 61.17 90 top
R6  130Ω  [R1206]  68.65 16.76 90 top
R7  130Ω  [R1206]  68.65 37.17 90 top
R8  130Ω  [R1206]  68.65 57.87 90 top
R9  130Ω  [R1206]  68.65 77.56 90 top
R10  130Ω  [R1206]  68.52 97.75 90 top
R11  3.1kΩ  [RES-TH_BD2.3-L3.7-P7.70-D0.9]  29.08 33.02 90 top
R12  1kΩ  [R1206]  30.6 39.94 180 top
R13  1.7kΩ  [RES-TH_BD2.7-L6.2-P10.20-D0.4]  12.32 31.88 90 top
R14  1kΩ  [R1206]  13.84 39.37 180 top
R15  10kΩ  [R1206]  14.78 75.58 180 top
R16  66.5Ω  [R1206]  9.78 70.36 0 top
RLY1  SRD-05VDC-SL-C  [RELAY-TH_SRD-XXVDC-XL-C]  81.28 14.98 0 top
RLY2  SRD-05VDC-SL-C  [RELAY-TH_SRD-XXVDC-XL-C]  81.28 35.53 0 top
RLY3  SRD-05VDC-SL-C  [RELAY-TH_SRD-XXVDC-XL-C]  81.28 55.81 0 top
RLY4  SRD-05VDC-SL-C  [RELAY-TH_SRD-XXVDC-XL-C]  81.28 75.85 0 top
RLY5  SRD-05VDC-SL-C  [RELAY-TH_SRD-XXVDC-XL-C]  81.28 95.88 0 top
SW1  DSWB05LHGET  [SW-TH_DSWB05LHGET]  44.45 44.58 90 top
SW2  TS-1101-C-W  [SW-SMD_L6.0-W3.3-LS8.0]  12.45 66.93 180 top
U5  EL354N(A)(TA)-VG  [OPTO-SMD-4_L4.4-W4.1-P2.54-LS7.0-TL]  57.28 72.9 270 top
U6  EL354N(A)(TA)-VG  [OPTO-SMD-4_L4.4-W4.1-P2.54-LS7.0-TL]  57.28 93.09 270 top
U7  EL354N(A)(TA)-VG  [OPTO-SMD-4_L4.4-W4.1-P2.54-LS7.0-TL]  57.28 32.38 270 top
U8  EL354N(A)(TA)-VG  [OPTO-SMD-4_L4.4-W4.1-P2.54-LS7.0-TL]  57.28 53.21 270 top
U10  EL354N(A)(TA)-VG  [OPTO-SMD-4_L4.4-W4.1-P2.54-LS7.0-TL]  57.28 12.19 270 top
U11  LM2575S-ADJ  [TO-263-5_L10.2-W8.9-P1.70-BR]  27.33 48.63 270 top
U12  LM2575S-ADJ  [TO-263-5_L10.2-W8.9-P1.70-BR]  10.57 48.5 270 top
U13  ZMM16V  [LL-34_L3.5-W1.5-RD]  6.98 35.94 180 top
U14  ZMM16V  [LL-34_L3.5-W1.5-RD]  23.88 35.81 180 top
U15  ESP32-WROVER-IB-N4R8  [WIFI-SMD_ESP32-WROVER-IE8MB]  21.59 88.64 90 top
U16  HB-PH3-25414PB2GOP  [HDR-TH_4P-P2.54-V-M]  17.9 102.61 0 top

## Footprints (pads in the part's own frame, mm; a bottom-side part is the same pattern mirrored in y, then rotated)
C1206
  rect 1.485x1.728 smd: 1(-1.593,0) 2(1.593,0)
C1210
  rect 1.635x2.7 smd: 1(-1.518,0) 2(1.518,0)
CONN-TH_3P-P5.08_DIBO_DB142R-5.08-3P
  round 2.3 hole 1.5: 1(-5.08,3.81) 1(-5.08,-3.81) 2(0,3.81) 2(0,-3.81) 3(5.08,3.81) 3(5.08,-3.81)
CONN-TH_DC-005-2.5A-2.0
  oval 1.8x4.2 hole 1.2x3.7: 1(2.999,2.35) 2(-2.999,2.35)
  oval 4.2x1.8 hole 3.7x1.2: 3(0,-2.35)
DO-41_BD2.4-L4.7-P8.70-D0.9-RD
  round 1.8 hole 1: 1(-4.35,0) 2(4.35,0)
HDR-TH_2P-P2.54-V-M
  rect 2x2 hole 1.2: 1(-1.27,0)
  round 2 hole 1.2: 2(1.27,0)
HDR-TH_4P-P2.54-V-M
  rect 1.7x1.7 hole 1.1: 1(-3.81,0)
  round 1.7 hole 1.1: 2(-1.27,0) 3(1.27,0) 4(3.81,0)
L1210
  rect 1.474x2.22 smd: 1(-1.703,0) 2(1.703,0)
LED1206-R-RD_RED
  rect 1.485x1.62 smd: 1(1.492,0) 2(-1.492,0)
LL-34_L3.5-W1.5-RD
  rect 1.1x1.7 smd: 1(-1.7,0) 2(1.7,0)
OPTO-SMD-4_L4.4-W4.1-P2.54-LS7.0-TL
  rect 1.7x0.95 smd: 1(-3.3,1.27) 2(-3.3,-1.27) 3(3.3,-1.27) 4(3.3,1.27)
R1206
  rect 1.208x1.701 smd: 1(-1.479,0) 2(1.479,0)
RELAY-TH_SRD-XXVDC-XL-C
  round 2.794 hole 1.524: 1(-5.1,-6) 2(7.1,-6) 3(7.1,6) 4(-5.1,6) 5(-7.1,0)
RES-TH_BD2.3-L3.7-P7.70-D0.9
  round 1.3 hole 0.7: 1(-3.81,0) 2(3.81,0)
RES-TH_BD2.7-L6.2-P10.20-D0.4
  round 1.4 hole 0.8: 1(-5.1,0) 2(5.1,0)
SW-SMD_L6.0-W3.3-LS8.0
  rect 1.9x1.5 smd: 1(-4,0) 2(4,0)
SW-TH_DSWB05LHGET
  round 1.6 hole 1: 1(-5.08,3.81) 2(-2.54,3.81) 3(0,3.81) 4(2.54,3.81) 5(5.08,3.81) 6(5.08,-3.81) 7(2.54,-3.81) 8(0,-3.81) 9(-2.54,-3.81) 10(-5.08,-3.81)
TO-263-5_L10.2-W8.9-P1.70-BR
  rect 3.083x1.02 smd: 1(5.16,-3.4) 2(5.16,-1.7) 3(5.16,0) 4(5.16,1.7) 5(5.16,3.4)
  rect 8.5x11 smd: 6(-5.16,0)
WIFI-SMD_ESP32-WROVER-IE8MB
  rect 2x0.9 smd: 1(-9,11.43) 2(-9,10.16) 3(-9,8.89) 4(-9,7.62) 5(-9,6.35) 6(-9,5.08) 7(-9,3.81) 8(-9,2.54) 9(-9,1.27) 10(-9,0) 11(-9,-1.27) 12(-9,-2.54) 13(-9,-3.81) 14(-9,-5.08) 15(-9,-6.35) 16(-9,-7.62) 17(-9,-8.89) 18(-9,-10.16) 19(-9,-11.43) 20(9,-11.43) 21(9,-10.16) 22(9,-8.89) 23(9,-7.62) 24(9,-6.35) 25(9,-5.08) 26(9,-3.81) 27(9,-2.54) 28(9,-1.27) 29(9,0) 30(9,1.27) 31(9,2.54) 32(9,3.81) 33(9,5.08) 34(9,6.35) 35(9,7.62) 36(9,8.89) 37(9,10.16) 38(9,11.43)
  rect 0.9x0.9 smd: 39(-2.895,5.015) 39(-2.895,3.62) 39(-2.895,2.225) 39(-1.5,5.015) 39(-1.5,3.62) 39(-1.5,2.225) 39(-0.105,5.015) 39(-0.105,3.62) 39(-0.105,2.225)

## Nets
As in the schematic.

Pads without a net: U15 4 5 6 7 8 9 16 17 18 19 20 21 22 23 24 26 27 28 29 30 31 32 33 36 37

## Via types
v1: diameter 0.601, hole 0.3, Top Layer to Bottom Layer, 7 vias

## Routing (per net, layer and track width the routed paths; a pad name or vN(x,y) marks a point on that pad's centre or on a via; arc(x,y) is an arc through that point)
+3V3: length 23.8
  Top Layer w0.5: v1(12.83,70.36) R16.2 11.12,70.5 C8.2 11.12,75.31 11.36,75.56 ; 11.36,75.56 13.03,75.56 13.14,75.45 ; 11.36,75.56 11.43,75.62 U15.2
  Top Layer w0.75: L2.1 8.38,27.56 9.16,26.78 R13.1 14.97,26.78 C4.1
  Bottom Layer w0.5: U16.4 23.5,102.61
+5V: length 121.3
  Top Layer w0.75: C2.1 R11.1 25.58,29.21 L1.1
  Top Layer w1: D4.1 63.21,79.12 73.45,79.12 RLY4.4 ; 62.61,98.58 63.09,99.06 73.36,99.06 RLY5.4 ; RLY2.4 73.26,38.61 63.21,38.61 D2.1 ; D3.1 63.34,59.31 73.67,59.31 RLY3.4 ; RLY1.4 73.36,18.16 63.09,18.16 D1.1
  Bottom Layer w1: D2.1 62.01,37.88 58.33,34.2 30.52,34.2 29.08,32.77 R11.1
VIN: length 93.6
  Top Layer w1.25: 12.83,13.65 15.11,13.65 C5.1 ; U11.1 24,43.4 24,40 22.85,38.85 20.83,38.85 ; 20.83,38.85 20.83,42 C1.2 ; 20.83,38.85 20.83,22.73 19.18,21.08 2.92,21.08 ; C3.2 2.92,41.59 2.92,21.08 ; 2.92,21.08 2.67,21.08 ; 2.92,21.08 2.92,15.24 4.57,13.59 12.83,13.59 12.83,13.59
  Top Layer w1.5: 12.83,13.59 13.08,13.33 ; 12.83,13.59 12.83,10.69 DC1.1 ; 12.83,13.59 12.83,13.65 ; U12.1 4.87,43.34 C3.2
RE1-ACT: length 33.5
  Top Layer w0.5: SW1.10 51.69,39.5 52.45,38.73 52.45,18.54 53.24,17.76 58.66,17.76 58.66,15.6 U10.1
RE1-COIL: length 17.7
  Top Layer w1: RLY1.1 76.12,8.92 LED1.2 68.58,8.86 58.58,8.86 58.55,8.89
RE1-COM: length 36.7
  Top Layer w2: CN1.2 CN1.2 101.47,14.98 RLY1.5
RE1-IN: length 97.4
  Top Layer w0.5: U15.10 21.59,72.01 22.1,71.5 44.07,71.5 44.83,70.74 44.83,16.26 45.59,15.49 U10.2
RE1-NC: length 22.9
  Top Layer w2: CN1.3 CN1.3 90.57,18.8 RLY1.3
RE1-NO: length 22.1
  Top Layer w2: RLY1.2 102.39,8.98 102.74,8.64 110.36,8.64
RE2-ACT: length 15.2
  Top Layer w0.5: SW1.9 51.44,42.04 54.23,39.24 58.66,39.24 58.66,35.79 U7.1
RE2-COIL: length 17.8
  Top Layer w1: RLY2.1 68.93,29.53 LED2.2 62.55,29.24 D2.2 62.39,29.08 U7.4
RE2-COM: length 36.7
  Top Layer w2: CN2.2 CN2.2 101.47,35.53 RLY2.5
RE2-IN: length 75.8
  Top Layer w0.5: U15.11 22.86,73.66 23.5,73.02 v1(45.34,73.02) ; U7.2 v1(56.01,37.59)
  Bottom Layer w0.5: v1(56.01,37.59) 54.61,37.59 53.85,38.35 53.85,72.14 52.96,73.02 v1(45.34,73.02)
RE2-NC: length 22.9
  Top Layer w2: RLY2.3 100.56,41.53 CN2.3 CN2.3
RE2-NO: length 22.1
  Top Layer w2: CN2.1 CN2.1 102.39,29.53 RLY2.2
RE3-ACT: length 28.3
  Top Layer w0.5: 58.55,59 58.57,59.02 ; 58.55,59 58.55,59.69 58.17,60.07 54.74,60.07 53.97,59.31 53.97,45.21 53.34,44.58 SW1.8 ; 58.55,59 U8.1
RE3-COIL: length 17.8
  Top Layer w1: U8.4 58.71,49.75 D3.2 68.58,49.75 LED3.2 76.05,49.69 RLY3.1
RE3-COM: length 36.7
  Top Layer w2: CN3.2 CN3.2 75.45,54.55 RLY3.5
RE3-IN: length 54.2
  Top Layer w0.5: v1(45.34,74.04) 24.64,74.04 24.13,74.55 U15.12 ; v1(56.01,58.42) U8.2
  Bottom Layer w0.5: v1(45.34,74.04) 55.12,74.04 56.01,73.15 v1(56.01,58.42)
RE3-NC: length 22.9
  Top Layer w2: CN3.3 CN3.3 100.56,61.81 RLY3.3
RE3-NO: length 22.1
  Top Layer w2: RLY3.2 88.73,49.47 CN3.1 CN3.1
RE4-ACT: length 44.9
  Top Layer w0.5: U5.1 58.55,79 58.05,79.5 53.47,79.5 52.71,78.74 52.71,47.75 52.07,47.12 SW1.7
RE4-COIL: length 17.7
  Top Layer w1: RLY4.1 76.09,69.75 LED4.2 62.55,69.75 D4.2 62.39,69.6 U5.4
RE4-COM: length 36.7
  Top Layer w2: CN4.2 CN4.2 101.47,75.85 RLY4.5
RE4-IN: length 39
  Top Layer w0.5: v1(45.34,75.31) 25.91,75.31 25.4,75.82 U15.13 ; v1(56.01,78.1) U5.2
  Bottom Layer w0.5: v1(45.34,75.31) 55.5,75.31 56.01,75.82 v1(56.01,78.1)
RE4-NC: length 22.9
  Top Layer w2: CN4.3 CN4.3 100.56,81.85 RLY4.3
RE4-NO: length 22.1
  Top Layer w2: CN4.1 CN4.1 88.73,69.5 88.38,69.85
RE5-ACT: length 62.7
  Top Layer w0.5: 58.55,98.17 58.55,98.62 58.57,98.64 ; 58.55,98.17 U6.1 ; 58.55,98.17 59.44,98.17 59.94,97.66 59.94,93.47 59.18,92.71 49.02,92.71 48.26,91.95 SW1.6
RE5-COIL: length 17.9
  Top Layer w1: 68.24,89.88 LED5.2 ; 68.24,89.88 76.18,89.88 ; 68.24,89.88 D5.2 62.52,89.79 U6.4
RE5-COM: length 36.7
  Top Layer w2: RLY5.5 75.45,94.61 CN5.2 CN5.2
RE5-IN: length 49
  Top Layer w0.5: U6.2 56,96.39 37.59,96.39 36.96,95.76 36.96,78.36 36.32,77.72 26.92,77.72 26.67,77.98 U15.14
RE5-NC: length 22.9
  Top Layer w2: RLY5.3 100.56,101.88 CN5.3 CN5.3
RE5-NO: length 22.1
  Top Layer w2: RLY5.2 102.39,89.88 CN5.1 CN5.1
RST: length 15.7
  Top Layer w0.5: SW2.1 16.45,70.49 C9.2 16.57,72.9 C6.1 16.44,75.4 16.26,75.58 16.26,76.96 15.62,77.6 13.33,77.6 12.7,78.24 U15.3
RX: length 5.5
  Top Layer w0.5: U15.34 15.24,98.89 16.63,100.29 U16.2
TX: length 5
  Top Layer w0.5: U16.1 14.09,97.77 U15.35
$1N1874: length 4.1
  Top Layer w1: LED1.1 R6.1 68.65,16.01
$1N2733: length 4.2
  Top Layer w1: 68.65,36.42 R7.1 LED2.1
$1N2848: length 4.4
  Top Layer w1: 68.65,57.12 R8.1 LED3.1
$1N2963: length 4.1
  Top Layer w1: 68.65,76.81 R9.1 LED4.1
$1N3078: length 4
  Top Layer w1: LED5.1 68.52,93.14 R10.1 68.52,96.99
$1N7448: length 11
  Top Layer w0.75: U11.2 25.58,43.41 U14.1 25.58,32.61 L1.2
$1N7557: length 6.7
  Top Layer w0.75: R11.2 29.08,39.9 R12.2 29.12,43.38 U11.4
$1N7965: length 10.8
  Top Layer w0.75: U12.2 8.87,36.13 U13.1 8.69,32.99 L2.2
$1N7972: length 6.4
  Top Layer w0.75: 12.32,39.32 R14.2 ; 12.32,39.32 R13.2 ; 12.32,39.32 12.32,43.29 U12.4
$1N9867: length 4.9
  Top Layer w0.5: U15.25 26.79,97.77 H1.2
$1N10273: length 2.7
  Top Layer w0.5: R16.1 8.14,70.2 LED6.1

## Copper pours and planes (outline as drawn; the poured copper is in the pictures)
+3V3 on Bottom Layer: 10.16,108.33 43.43,108.33 43.43,25.15 10.16,25.15
+5V on Bottom Layer: 58.42,106.17 85.09,106.17 85.09,2.54 58.42,2.54
GND on Top Layer: -2.79,113.28 117.22,113.28 117.22,-1.4 -2.79,-1.4

## Text on the board
Top Silkscreen Layer: BOOT JMP | NC | NO | COM | Reset | FLASH | 7.5-12VDC / 2A Max | Inverter | RELAY #1 | RELAY #2 | RELAY #3 | RELAY #4 | RELAY #5 | ALIVEculture / Relais 5x / V1.00 | TX RX GND +3V3
